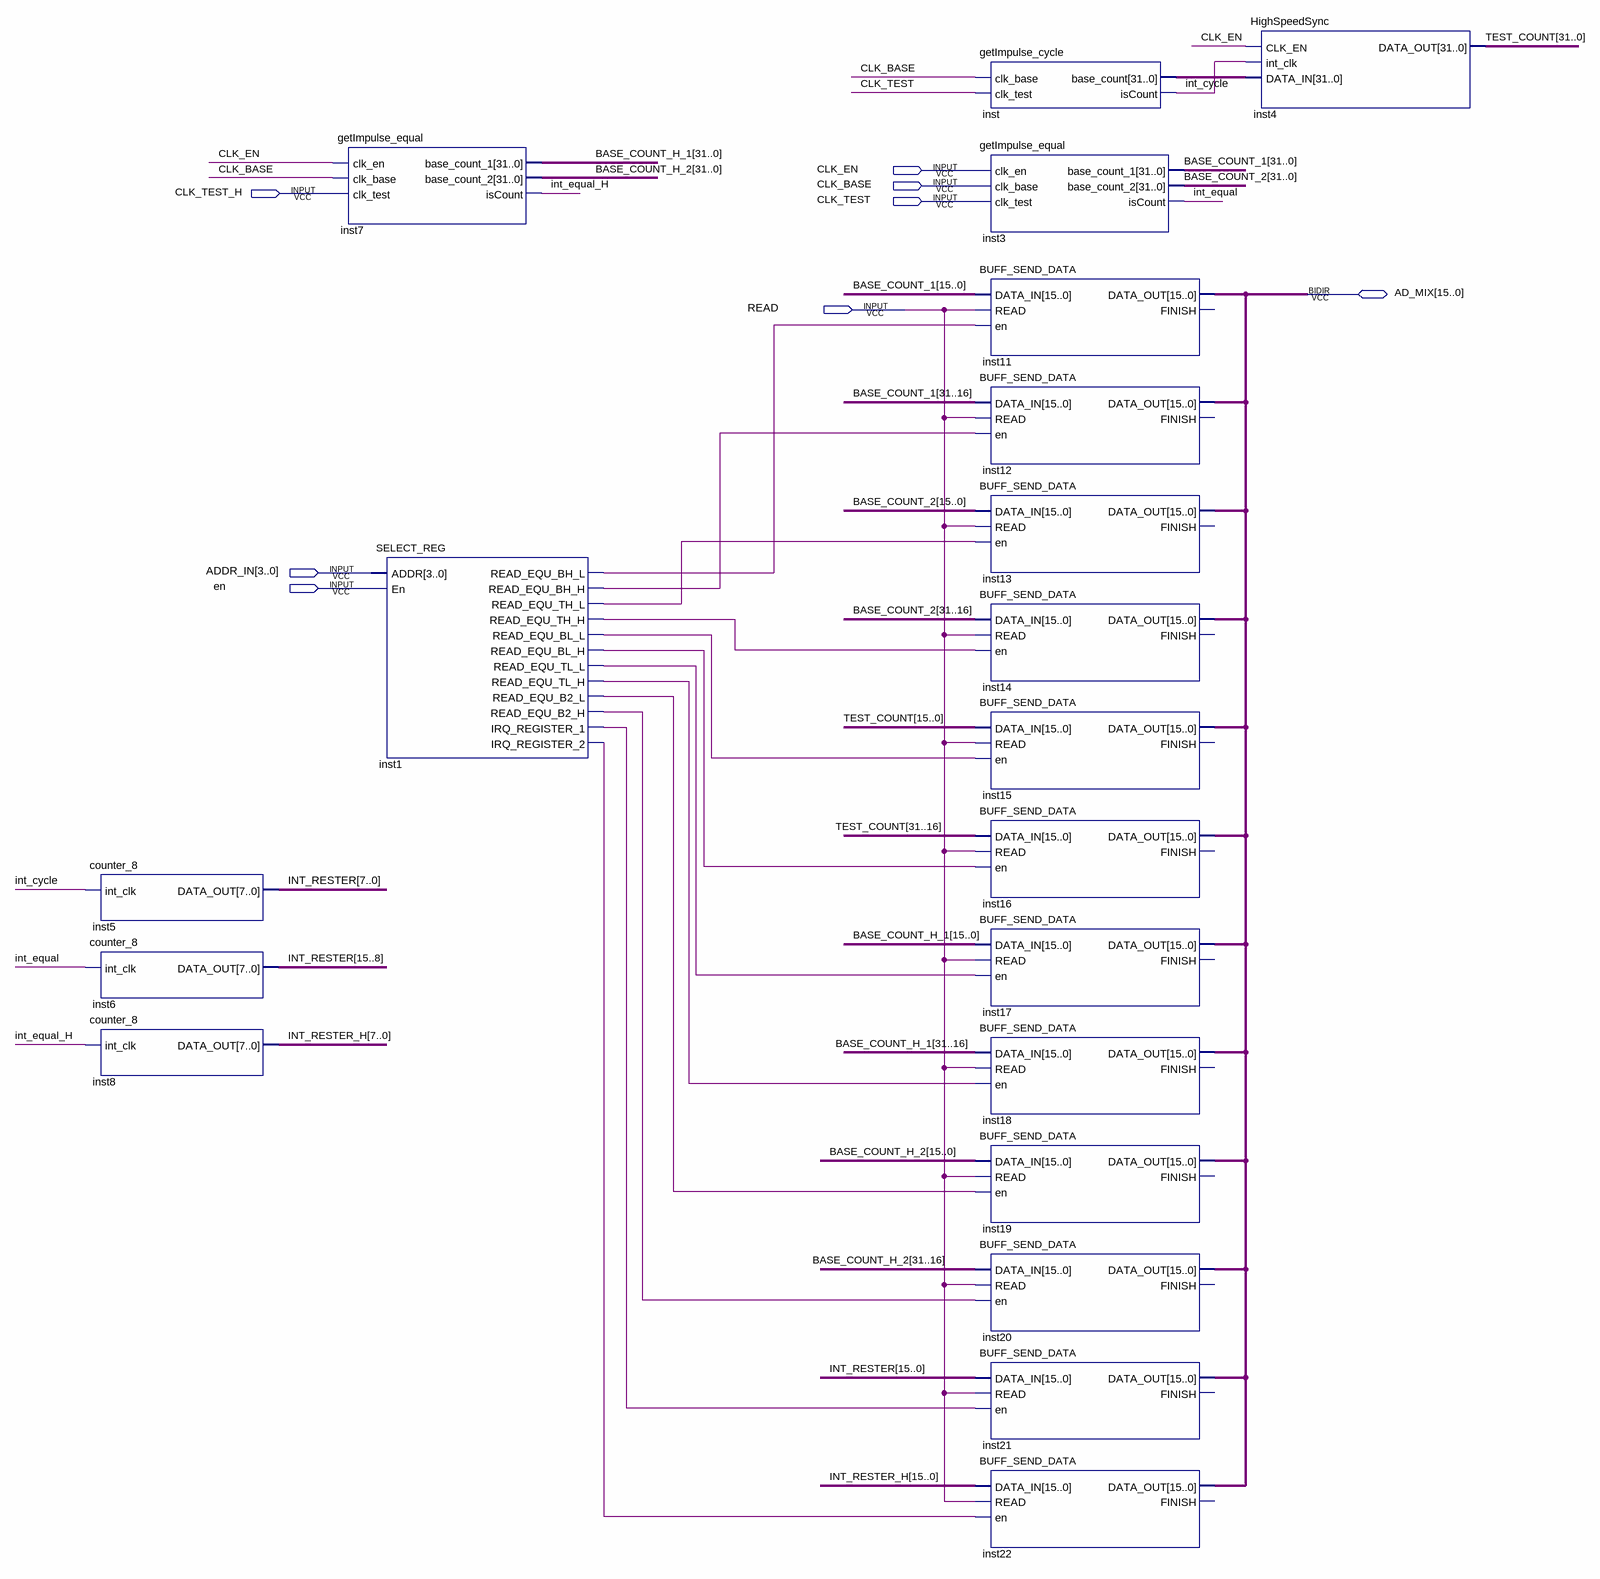
[diagram p0: schematic sheet]
// Quartus schematic impulse.bdf as structural Verilog: 20 symbols, 8 pins
module impulse (
  input  CLK_EN,
  input  CLK_BASE,
  input  CLK_TEST_H,
  input  CLK_TEST,
  input  READ,
  input  [3:0] ADDR_IN,
  input  en,
  inout  [15:0] AD_MIX
);

  wire inst1_irq_register_1, inst1_irq_register_2, inst1_read_equ_b2_h, inst1_read_equ_b2_l,
       inst1_read_equ_bh_h, inst1_read_equ_bh_l, inst1_read_equ_bl_h, inst1_read_equ_bl_l,
       inst1_read_equ_th_h, inst1_read_equ_th_l, inst1_read_equ_tl_h, inst1_read_equ_tl_l, int_cycle,
       int_equal, int_equal_H;
  wire [15:0] INT_RESTER, INT_RESTER_H;
  wire [31:0] BASE_COUNT_1, BASE_COUNT_2, BASE_COUNT_H_1, BASE_COUNT_H_2, inst_base_count, TEST_COUNT;

  counter_8 inst5 (.int_clk(int_cycle), .DATA_OUT(INT_RESTER[7:0]));
  counter_8 inst6 (.int_clk(int_equal), .DATA_OUT(INT_RESTER[15:8]));
  counter_8 inst8 (.int_clk(int_equal_H), .DATA_OUT(INT_RESTER_H[7:0]));
  getImpulse_equal inst7 (
    .clk_en(CLK_EN), .clk_base(CLK_BASE), .clk_test(CLK_TEST_H), .base_count_1(BASE_COUNT_H_1),
    .base_count_2(BASE_COUNT_H_2), .isCount(int_equal_H));
  SELECT_REG inst1 (
    .ADDR(ADDR_IN), .En(en), .READ_EQU_BH_L(inst1_read_equ_bh_l), .READ_EQU_BH_H(inst1_read_equ_bh_h),
    .READ_EQU_TH_L(inst1_read_equ_th_l), .READ_EQU_TH_H(inst1_read_equ_th_h),
    .READ_EQU_BL_L(inst1_read_equ_bl_l), .READ_EQU_BL_H(inst1_read_equ_bl_h),
    .READ_EQU_TL_L(inst1_read_equ_tl_l), .READ_EQU_TL_H(inst1_read_equ_tl_h),
    .READ_EQU_B2_L(inst1_read_equ_b2_l), .READ_EQU_B2_H(inst1_read_equ_b2_h),
    .IRQ_REGISTER_1(inst1_irq_register_1), .IRQ_REGISTER_2(inst1_irq_register_2));
  getImpulse_cycle inst (.clk_base(CLK_BASE), .clk_test(CLK_TEST), .base_count(inst_base_count), .isCount(int_cycle));
  getImpulse_equal inst3 (
    .clk_en(CLK_EN), .clk_base(CLK_BASE), .clk_test(CLK_TEST), .base_count_1(BASE_COUNT_1),
    .base_count_2(BASE_COUNT_2), .isCount(int_equal));
  BUFF_SEND_DATA inst11 (
    .DATA_IN(BASE_COUNT_1[15:0]), .READ(READ), .en(inst1_read_equ_bh_l), .DATA_OUT(AD_MIX));  // open: FINISH
  BUFF_SEND_DATA inst12 (
    .DATA_IN(BASE_COUNT_1[31:16]), .READ(READ), .en(inst1_read_equ_bh_h), .DATA_OUT(AD_MIX));  // open: FINISH
  BUFF_SEND_DATA inst13 (
    .DATA_IN(BASE_COUNT_2[15:0]), .READ(READ), .en(inst1_read_equ_th_l), .DATA_OUT(AD_MIX));  // open: FINISH
  BUFF_SEND_DATA inst14 (
    .DATA_IN(BASE_COUNT_2[31:16]), .READ(READ), .en(inst1_read_equ_th_h), .DATA_OUT(AD_MIX));  // open: FINISH
  BUFF_SEND_DATA inst15 (
    .DATA_IN(TEST_COUNT[15:0]), .READ(READ), .en(inst1_read_equ_bl_l), .DATA_OUT(AD_MIX));  // open: FINISH
  BUFF_SEND_DATA inst16 (
    .DATA_IN(TEST_COUNT[31:16]), .READ(READ), .en(inst1_read_equ_bl_h), .DATA_OUT(AD_MIX));  // open: FINISH
  BUFF_SEND_DATA inst17 (
    .DATA_IN(BASE_COUNT_H_1[15:0]), .READ(READ), .en(inst1_read_equ_tl_l), .DATA_OUT(AD_MIX));  // open: FINISH
  BUFF_SEND_DATA inst18 (
    .DATA_IN(BASE_COUNT_H_1[31:16]), .READ(READ), .en(inst1_read_equ_tl_h), .DATA_OUT(AD_MIX));  // open: FINISH
  BUFF_SEND_DATA inst19 (
    .DATA_IN(BASE_COUNT_H_2[15:0]), .READ(READ), .en(inst1_read_equ_b2_l), .DATA_OUT(AD_MIX));  // open: FINISH
  BUFF_SEND_DATA inst20 (
    .DATA_IN(BASE_COUNT_H_2[31:16]), .READ(READ), .en(inst1_read_equ_b2_h), .DATA_OUT(AD_MIX));  // open: FINISH
  BUFF_SEND_DATA inst21 (
    .DATA_IN(INT_RESTER), .READ(READ), .en(inst1_irq_register_1), .DATA_OUT(AD_MIX));  // open: FINISH
  BUFF_SEND_DATA inst22 (
    .DATA_IN(INT_RESTER_H), .READ(READ), .en(inst1_irq_register_2), .DATA_OUT(AD_MIX));  // open: FINISH
  HighSpeedSync inst4 (.CLK_EN(CLK_EN), .int_clk(int_cycle), .DATA_IN(inst_base_count), .DATA_OUT(TEST_COUNT));
endmodule
